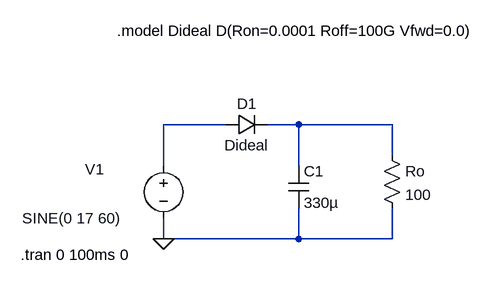
[diagram p0: schematic Ex2.asc]
Ex2.asc, the LTspice schematic file:
Version 4
SHEET 1 880 680
WIRE 144 80 48 80
WIRE 256 80 208 80
WIRE 400 80 256 80
WIRE 400 128 400 80
WIRE 48 144 48 80
WIRE 256 144 256 80
WIRE 48 256 48 224
WIRE 256 256 256 208
WIRE 256 256 48 256
WIRE 400 256 400 208
WIRE 400 256 256 256
FLAG 48 256 0
SYMBOL voltage 48 128 R0
WINDOW 0 -121 21 Left 2
WINDOW 3 -218 96 Left 2
WINDOW 123 0 0 Left 0
WINDOW 39 0 0 Left 0
SYMATTR InstName V1
SYMATTR Value SINE(0 17 60)
SYMBOL diode 144 96 R270
WINDOW 0 32 32 VTop 2
WINDOW 3 0 32 VBottom 2
SYMATTR InstName D1
SYMATTR Value Dideal
SYMBOL cap 240 144 R0
SYMATTR InstName C1
SYMATTR Value 330µ
SYMBOL res 384 112 R0
SYMATTR InstName Ro
SYMATTR Value 100
TEXT -24 -64 Left 2 !.model Dideal D(Ron=0.0001 Roff=100G Vfwd=0.0)
TEXT -172 280 Left 2 !.tran 0 100ms 0

The netlist it stands for:
* Ex2.asc
V1 N001 0 SINE(0 17 60)
D1 N001 N002 Dideal
C1 N002 0 330µ
Ro N002 0 100
.model D D
.lib standard.dio
.model Dideal D(Ron=0.0001 Roff=100G Vfwd=0.0)
.tran 0 100ms 0
.backanno
.end